# EAGLE schematic esp32_pwr (EAGLE 9.6.2)
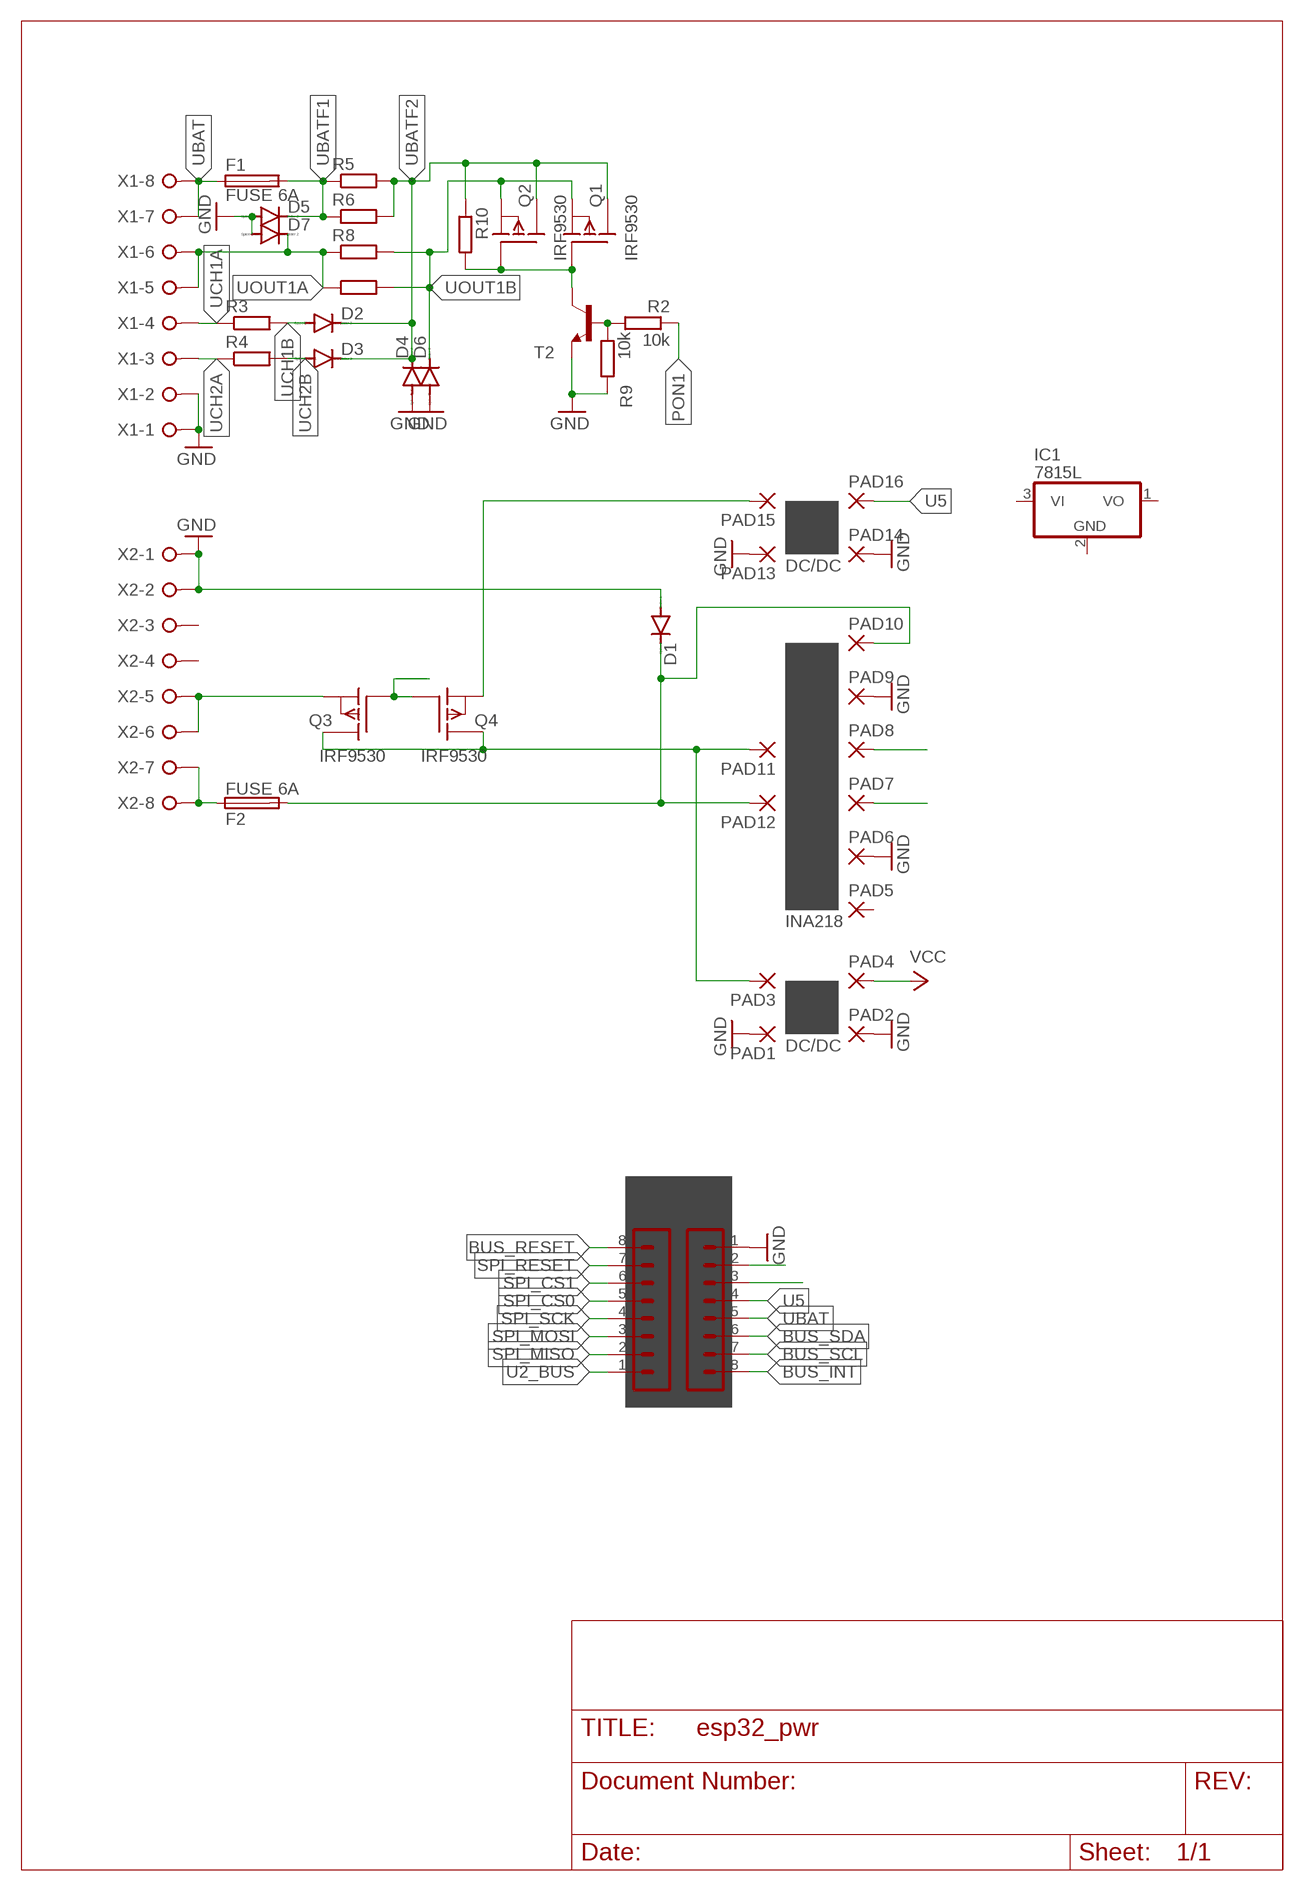
[diagram p0: schematic, sheet 1]

## Parts
D1  DIODE-MELF-MLL41  [MELF-MLL41]
D2  DIODE-MELF-MLL41  [MELF-MLL41]
D3  DIODE-MELF-MLL41  [MELF-MLL41]
D4  DIODE-MELF-MLL41  [MELF-MLL41]
D5  DIODE-MELF-MLL41  [MELF-MLL41]
D6  DIODE-MELF-MLL41  [MELF-MLL41]
D7  DIODE-MELF-MLL41  [MELF-MLL41]
F1  FUSE 6A  FUSESH22,5A  [SH22,5A]
F2  FUSE 6A  FUSESH22,5A  [SH22,5A]
IC1  7815L  [TO92]
L  MA08-1  [MA08-1]
PAD1  2,15/1,0  [2,15/1,0]
PAD2  2,15/1,0  [2,15/1,0]
PAD3  2,15/1,0  [2,15/1,0]
PAD4  2,15/1,0  [2,15/1,0]
PAD5  2,15/1,0  [2,15/1,0]
PAD6  2,15/1,0  [2,15/1,0]
PAD7  2,15/1,0  [2,15/1,0]
PAD8  2,15/1,0  [2,15/1,0]
PAD9  2,15/1,0  [2,15/1,0]
PAD10  2,15/1,0  [2,15/1,0]
PAD11  2,15/1,0  [2,15/1,0]
PAD12  2,15/1,0  [2,15/1,0]
PAD13  2,15/1,0  [2,15/1,0]
PAD14  2,15/1,0  [2,15/1,0]
PAD15  2,15/1,0  [2,15/1,0]
PAD16  2,15/1,0  [2,15/1,0]
Q1  IRF9530  [TO220]
Q2  IRF9530  [TO220]
Q3  IRF9530  [TO220]
Q4  IRF9530  [TO220]
R  MA08-1  [MA08-1]
R2  10k  R-EU_R0805  [R0805]
R3  R-EU_R2512  [R2512]
R4  R-EU_R2512  [R2512]
R5  R-EU_R2512  [R2512]
R6  R-EU_R2512  [R2512]
R7  R-EU_R2512  [R2512]
R8  R-EU_R2512  [R2512]
R9  10k  R-EU_R0805  [R0805]
R10  R-EU_R0805  [R0805]
T2  BC817-16-NPN-SOT23-BEC  [SOT23-BEC]
X1  W237-08P  [W237-8P]
X2  W237-08P  [W237-8P]

## Nets
BUS_INT: R.8
BUS_RESET: L.8
BUS_SCL: R.7
BUS_SDA: R.6
GND [gnd]: D1.A D4.A D5.A D6.A D7.A PAD1.1(P) PAD2.1(P) PAD6.1(P) PAD9.1(P) PAD13.1(P) PAD14.1(P) R9.2 R.1 T2.E X1.1 X1.2 X2.1 X2.2
N$1: Q1.1(G) Q2.1(G) R10.2 T2.C
N$2: F2.1 X2.7 X2.8
N$3: D1.C F2.2 PAD10.1(P) PAD12.1(P)
N$4: PAD3.1(P) PAD11.1(P) Q3.2(D) Q4.2(D)
N$5: PAD7.1(P)
N$6: PAD8.1(P)
N$7: PAD15.1(P) Q4.3(S)
N$8: Q3.3(S) X2.5 X2.6
N$9: Q3.1(G) Q4.1(G)
N$51: R2.2 R9.1 T2.B
PON1: R2.1
SPI_CS0: L.5
SPI_CS1: L.6
SPI_MISO: L.2
SPI_MOSI: L.3
SPI_RESET: L.7
SPI_SCK: L.4
U2_BUS: L.1
U5 [power]: PAD16.1(P) R.4
U33A [power]: R.2
U33B [power]: R.3
UBAT [power]: F1.1 R.5 X1.7 X1.8
UBATF1: D5.C F1.2 R5.1 R6.1
UBATF2: D2.C D3.C D4.C Q1.2(D) Q2.2(D) R5.2 R6.2 R10.1
UCH1A: R3.1 X1.4
UCH1B: D2.A R3.2
UCH2A: R4.1 X1.3
UCH2B: D3.A R4.2
UOUT1A: D7.C R7.1 R8.1 X1.5 X1.6
UOUT1B: D6.C Q1.3(S) Q2.3(S) R7.2 R8.2
VCC [power]: PAD4.1(P)
Unconnected: IC1.1(VO) IC1.2(GND) IC1.3(VI) PAD5.1(P) X2.3 X2.4

## Notes on the sheet
- DC/DC
- INA218
- DC/DC

## Library data of the parts
D1-D7 = diode:DIODE-: DIODE
F1 F2 = fuse:FUSE: Fuse; OC_FARNELL: unknown; OC_NEWARK: unknown
IC1 = linear:78*: Positive VOLTAGE REGULATOR Source: http://cache.national.com/ds/LM/LM78L05.pdf http://www.fairchildsemi.com/ds/LM/LM7805.pdf
L R = con-lstb:MA08-1: PIN HEADER; OC_FARNELL: unknown; OC_NEWARK: unknown
PAD1-PAD16 = wirepad:2,15/1,0: THROUGH-HOLE PAD
Q1-Q4 = transistor-fet:IRF9530: P-Channel Enhancement MOSFET (HEXFET); -100V; -12A; 0,3Ohm
R2 R9 = rcl:R-EU_: RESISTOR, European symbol
R3-R8 R10 = rcl:R-EU_: RESISTOR, European symbol; SPICEPREFIX: R
T2 = transistor:*-NPN-: NPN Transistror BF959 corrected 2008.03.06
X1 X2 = con-wago-508:W237-08P: WAGO SREW CLAMP; OC_FARNELL: unknown; OC_NEWARK: unknown

## Net classes
1 gnd: width 0.381 mm, drill 0.381 mm
2 power: width 0.381 mm, drill 0.381 mm